# Altium schematic sheet CW340_Clocks.SchDoc: PLL, Clocks for FPGA
size Letter; DocumentNumber: .; Revision: .; SheetNumber: 29; SheetTotal: 31; SheetApproved: NO
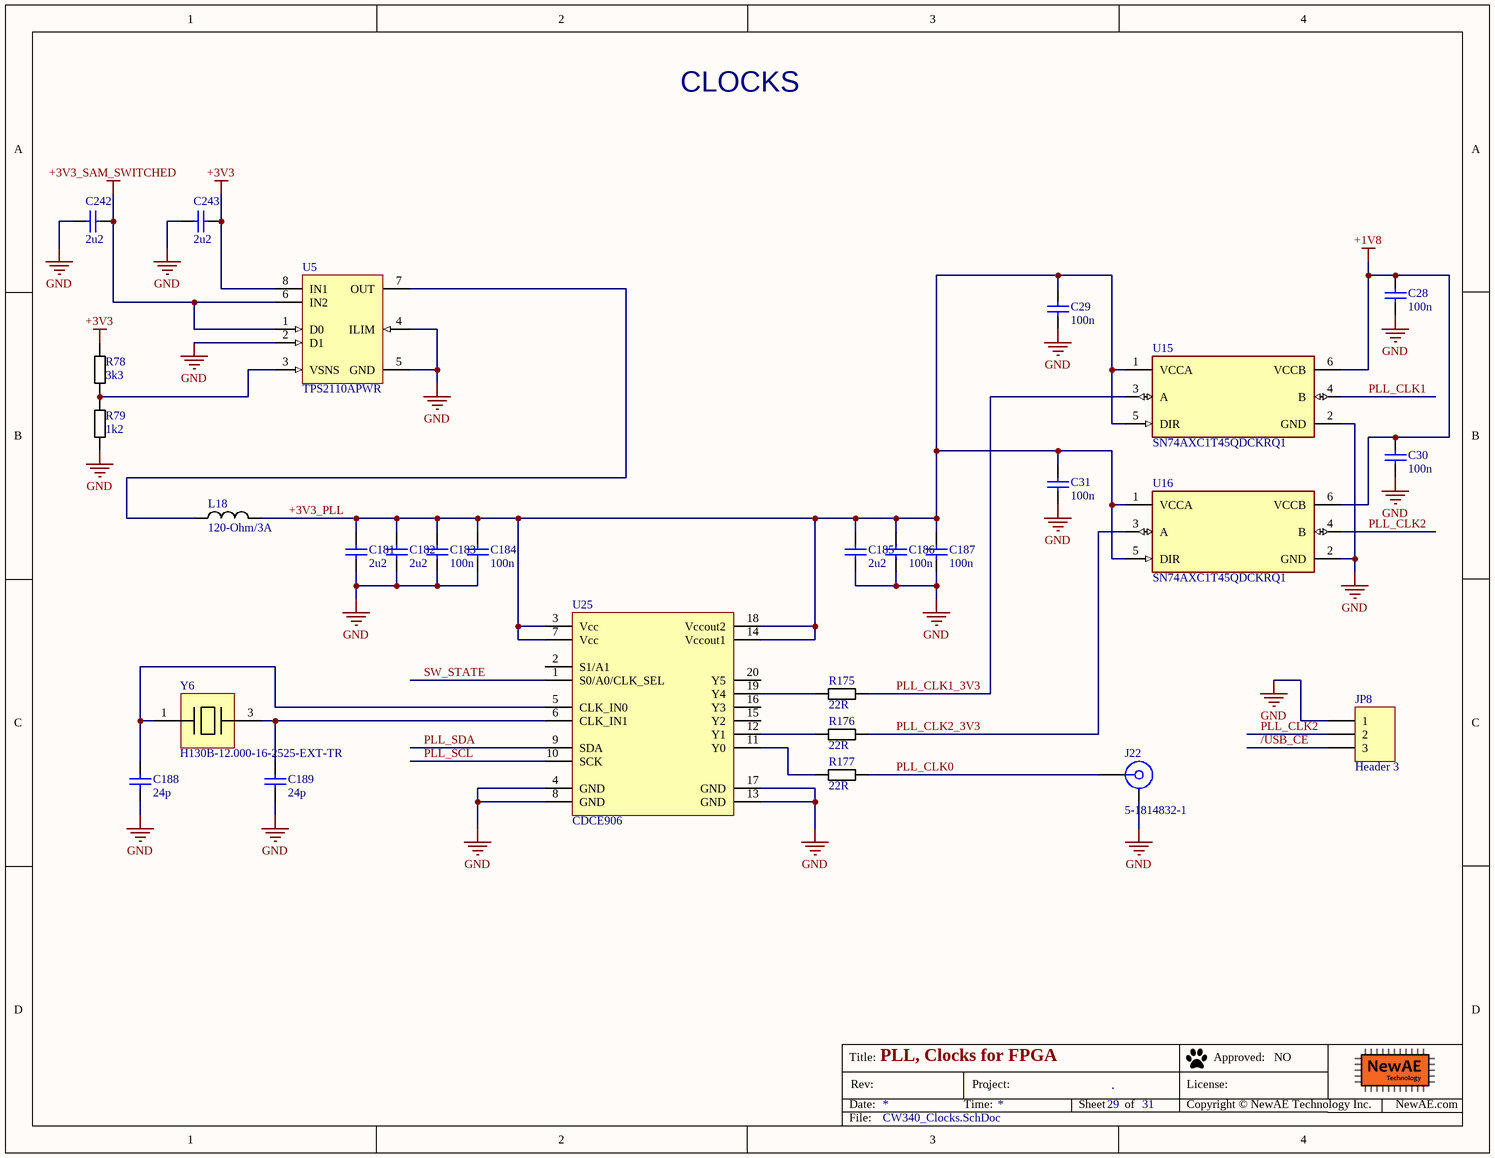
[diagram p0: CW340_Clocks.SchDoc]

## Parts
C28  100n  [CAPC0402_M]
C29  100n  [CAPC0402_M]
C30  100n  [CAPC0402_M]
C31  100n  [CAPC0402_M]
C181  2u2  [CAPC0603_M]
C182  2u2  [CAPC0603_M]
C183  100n  [CAPC0402_M]
C184  100n  [CAPC0402_M]
C185  2u2  [CAPC0603_M]
C186  100n  [CAPC0402_M]
C187  100n  [CAPC0402_M]
C188  24p  [CAPC0402_M]
C189  24p  [CAPC0402_M]
C242  2u2  [CAPC0603_M]
C243  2u2  [CAPC0603_M]
J22  5-1814832-1  [SMA_VERT_1.65MMHOLE]
JP8  Header 3  [HDR1X3]
L18  120-Ohm/3A  [IND_0603]
R78  3k3  [RESC1005X40N]
R79  1k2  [RESC1005X40N]
R175  22R  [RESC1005X40N]
R176  22R  [RESC1005X40N]
R177  22R  [RESC1005X40N]
U5  TPS2110APWR  [PW0008A_L]
U15  SN74AXC1T45QDCKRQ1  [FP-DCK0006A-MFG]
U16  SN74AXC1T45QDCKRQ1  [FP-DCK0006A-MFG]
U25  CDCE906  [TSSOP065-20-PW]
Y6  H130B-12.000-16-2525-EXT-TR  [5x3.2mm XTAL]

## Nets
+1V8: C28.1 C30.1 U15.6(VCCB) U16.6(VCCB)
+3V3: C243.2 R78.1 U5.8(IN1)
+3V3_SAM_SWITCHED: C242.2 U5.1(D0) U5.6(IN2)
GND: C28.2 C29.2 C30.2 C31.2 C181.2 C182.2 C183.2 C184.2 C185.2 C186.2 C187.2 C188.2 C189.2 C242.1 C243.1 J22.MH JP8.1 R79.2 U5.2(D1) U5.4(ILIM) U5.5(GND) U15.2(GND) U16.2(GND) U25.4(GND) U25.8(GND) U25.13(GND) U25.17(GND)
+3V3_PLL: C29.1 C31.1 C181.1 C182.1 C183.1 C184.1 C185.1 C186.1 C187.1 L18.2 U15.1(VCCA) U15.5(DIR) U16.1(VCCA) U16.5(DIR) U25.3(Vcc) U25.7(Vcc) U25.14(Vccout1) U25.18(Vccout2)
/USB_CE: JP8.3
PLL_CLK0: J22.1 R177.2
PLL_CLK1: U15.4(B)
PLL_CLK1_3V3: R175.2 U15.3(A)
PLL_CLK2: JP8.2 U16.4(B)
PLL_CLK2_3V3: R176.2 U16.3(A)
PLL_SCL: U25.10(SCK)
PLL_SDA: U25.9(SDA)
SW_STATE: U25.1(S0/A0/CLK_SEL)
NetC188_1: C188.1 U25.5(CLK_IN0) Y6.1
NetC189_1: C189.1 U25.6(CLK_IN1) Y6.3
NetL18_1: L18.1 U5.7(OUT)
NetR78_2: R78.2 R79.1 U5.3(VSNS)
NetR175_1: R175.1 U25.19(Y4)
NetR176_1: R176.1 U25.12(Y1)
NetR177_1: R177.1 U25.11(Y0)

Not connected (* = marked no-connect by the designer): U25 2(S1/A1) 15(Y2) 16(Y3) 20(Y5)

## Notes on the sheet
- CLOCKS
- Title:
- Date:
- Rev:
- Time:
- Project:
- Sheet
- of
- License:
- Copyright © NewAE Technology Inc.
- Approved:
- NewAE.com
- File:

## Library data of the parts
C28-C31 C183 C184 C186 C187 = CCHIP-100n-0402: 100n, 0402; Manufacture Part Number 1: CGA2B3X7R1V104K050BB; Component Group: Capacitor; Case-EIA: 0402; Part Number: CCHIP-100n-0402; Footprint: 0402; Pin Count: 2; Value: 100n; Mounting Technology: SMT; Component Kind: Standard; Component Type: Standard; Supplier 1: Digi-Key; Supplier Part Number 1: 445-6901-1-ND
C181 C182 C185 C242 C243 = CCHIP-2u2-0603-16V: 2u2, 0603; Manufacture 1: Taiyo Yuden; Manufacture Part Number 1: EMK107BJ225KA-T; Component Group: Capacitor; Case-EIA: 0603; Case-Metric: 1608; Rated Voltage: 16VDC; Part Number: CCHIP-2u2-0603-16V; Footprint: 0603; Pin Count: 2; Supplier 1: Digi-Key; Supplier Part Number 1: 587-1430-1-ND; Value: 2u2; Mounting Technology: SMT; Component Kind: Standard; Component Type: Standard
C188 C189 = CCHIP-24p-0402: 24p, 0402; Manufacture 1: Murata Electronics; Manufacture Part Number 1: GCM1555C1H240FA16D; Component Group: Capacitor; Case-EIA: 0402; Case-Metric: 1005; Rated Voltage: 50V; Part Number: CCHIP-24p-0402; Footprint: 0402; Pin Count: 2; Supplier 1: Digi-Key; Supplier Part Number 1: 490-GCM1555C1H240FA16DTR-ND; Value: 24p; Mounting Technology: SMT; RoHS: Yes; Component Kind: Standard; Component Type: Standard
J22 = 5-1814832-1: SMA, Vert; Manufacture 1: TE Connectivity; Component Group: Connector; Part Number: 5-1814832-1; Manufacture Part Number 1: 5-1814832-1; Pin Count: 2; Supplier 1: Digi-Key; Supplier Part Number 1: A97594-ND; Component Kind: Standard; Component Type: Standard
JP8 = Header 3: Header, 3-Pin; LatestRevisionDate: 17-Jul-2002; LatestRevisionNote: Re-released for DXP Platform.; Publisher: Altium Limited
L18 = FBCHIP-120R-0603: 120 Ohm @ 100 MHz, 3A rated FB; Manufacture 1: Murata Electronics; Manufacture Part Number 1: BLM18SG121TN1D; Component Group: Inductor; Value: 120R/3A; Case-EIA: 0603; Case-Metric: 1680; PP Material Stack: 0; Part Number: FBCHIP-120R-0603; Footprint: 0603; Pin Count: 2; Supplier 1: Digi-Key; Supplier Part Number 1: 490-3996-1-ND; Rated Power: 3A; Component Kind: Standard; Component Type: Standard; PP Rotation: 0
R78 = RCHIP-3K3-0402: 3k3 res, 0402, 1%, 1/16W; Manufacture 1: Yageo; Manufacture Part Number 1: RC0402FR-073K3L; Component Group: Resistor; Case-EIA: 0402; Case-Metric: 1005; Rated Power: 0.063W; Rated Voltage: 75VDC; Part Number: RCHIP-3K3-0402; Footprint: 0402; Pin Count: 2; Supplier 1: Digi-Key; Supplier Part Number 1: 311-3.30KLRCT-ND; Value: 3k3; Tolerance: 1%; Mounting Technology: SMT; Temperature Range: -55C to 155C; Component Kind: Standard; Component Type: Standard
R79 = RCHIP-1K2-0402: 1k2 res, 0402, 1%, 1/16W; Manufacture 1: Yageo; Manufacture Part Number 1: RC0402FR-071K2L; Component Group: Resistor; Case-EIA: 0402; Case-Metric: 1005; Rated Power: 0.063W; Rated Voltage: 75VDC; Part Number: RCHIP-1K2-0402; Footprint: 0402; Pin Count: 2; Supplier 1: Digi-Key; Supplier Part Number 1: 311-1.20KLRCT-ND; Value: 1k2; Tolerance: 1%; Mounting Technology: SMT; Temperature Range: -55C to 155C; Component Kind: Standard; Component Type: Standard
R175-R177 = RCHIP-22R-0402: 22R res, 0402, 1%, 1/16W; Manufacture 1: Yageo; Manufacture Part Number 1: RC0402FR-0722RL; Component Group: Resistor; Case-EIA: 0402; Case-Metric: 1005; Rated Power: 0.063W; Rated Voltage: 75VDC; Part Number: RCHIP-22R-0402; Footprint: 0402; Pin Count: 2; Supplier 1: Digi-Key; Supplier Part Number 1: 311-22.0LRCT-ND; Value: 22R; Tolerance: 1%; Mounting Technology: SMT; Temperature Range: -55C to 155C; Component Kind: Standard; Component Type: Standard
U5 = CMP-0339-00059-2: Dual In / Single Out Autoswitching Power Mux, 2.8 to 5.5 V, -40 to 85 degC, 8-pin TSSOP (PW), Green (RoHS & no Sb/Br); Manufacturer: Texas Instruments; SubFamily: Power Multiplexer (MUX); Number of Inputs: 2; IN2 Output Current(Max)(A): 0.75; IN1 rDS(on)(Typ)(mOhm): 120; IN1, IN2 Input Voltage(Max)(V): 5.5; IN2 rDS(on)(Typ)(Ohms): 0.12; IN1, IN2 Input Voltage(Min)(V): 2.8; PackageReference: PW0008A; ComponentLink1URL: http://www.ti.com/general/docs/lit/getliterature.tsp?genericPartNumber=TPS2110A&fileType=pdf; ComponentLink1Description: Datasheet; PackageDescription: 8-Pin Plastic Thin Small Outline Package 3 x 4.4 mm Body ,0.65 mm Pitch; Eco-Plan: Green (RoHS & no Sb/Br); PartNumber: TPS2110APWR; PackageVersion: revG, Feb-2011; Code_JEDEC: MO-153; IN1 Output Current(Max)(A): 0.75; Mounting Technology: Surface Mount; DatasheetVersion: SBVS043A
U15 U16 = CMP-04899-000038-1: IC LOGIC BUFFER/DRIVER
U25 = CDCE906PW: IC 3-PLL SYNTH/MULT/DIV 20-TSSOP; Manufacture 1: Texas Instruments; Component Group: Digital IC; PP Material Stack: 0; Part Number: CDCE906PW; Footprint: 20-TSSOP; Manufacture Part Number 1: CDCE906PW; Pin Count: 20; Supplier 1: Digi-Key; Supplier Part Number 1: 296-20675-5-ND; Mounting Technology: SMT; RoHS: Yes; Component Kind: Standard; Component Type: Standard; PP Rotation: 0
Y6 = H130B-12.000-16-2525-EXT-TR: 12MHz ±25ppm Crystal 16pF 35 Ohms 4-SMD, No Lead; Manufacture 1: Raltron Electronics; Value: 12.000MHz; PP Material Stack: 0; Supplier 1: Digi-Key; Stock 1: 4955; Pricing 1: 1=0.590000, 10=0.488000, 50=0.439400, 100=0.390600, 500=0.371100 (USD); Supplier Part Number 1: 2151-H130B-12.000-16-2525-EXT-TR-ND; .Checked SCH: *; .Checked PCB: *; Manufacturer Part Number: H130B-12.000-16-2525-EXT-TR; Part Number: H130B-12.000-16-2525-EXT-TR; Component Group: Crystal; Footprint: TBD; Manufacture Part Number 1: H130B-12.000-16-2525-EXT-TR; Pin Count: 4; Mounting Technology: SMT; Component Kind: Standard; Component Type: Standard; PP Rotation: 0